# Altium schematic sheet LPCB218 - MLP INTERFACE.SchDoc
size A3; Address1: Factory 10; Address2: 9-13 Dingley Avenue, Dandeong, VICTORIA 3175, AUSTRALIA; DocumentNumber: 12; Revision: 1; SheetNumber: 12; SheetTotal: 14; Lockie__PCB_SUB_ASSEMBLY: MLP Interface; Lockie__PCB_ASSEMBLY: Command Node; Lockie__LDL: LPCB218; Lockie__PCB_DESCRIPTION: Command Node
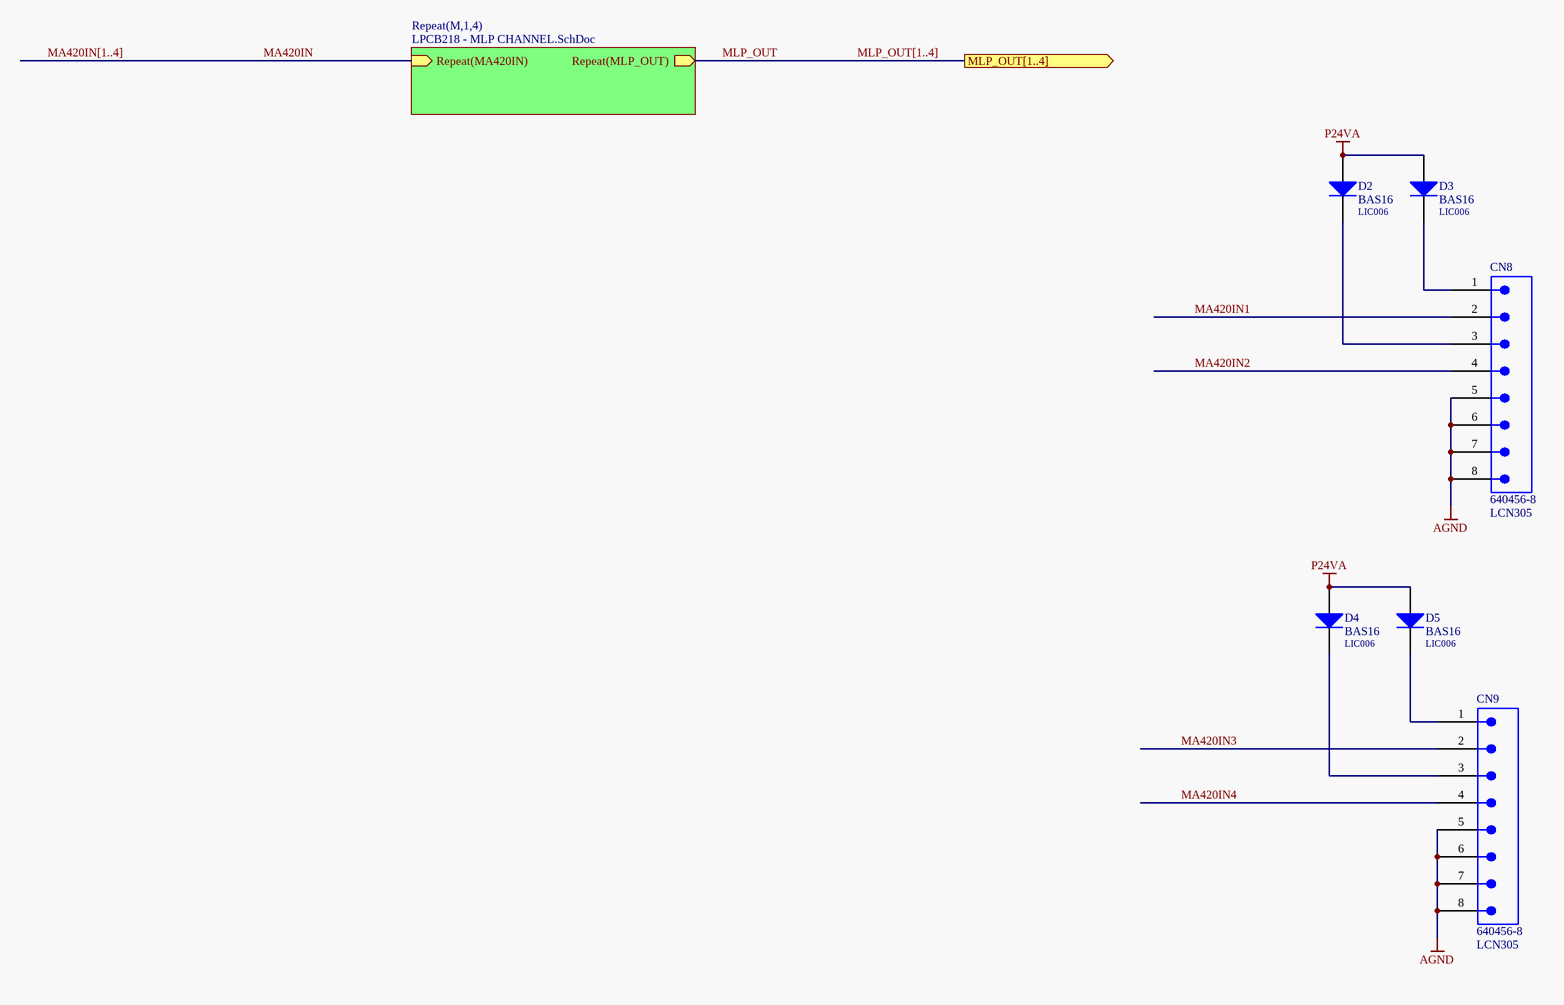
[diagram p0: LPCB218 - MLP INTERFACE.SchDoc]

## Parts
CN8  640456-8  LDL_NUMBER: LCN305  [640456-8]
CN9  640456-8  LDL_NUMBER: LCN305  [640456-8]
D2  BAS16  LDL_NUMBER: LIC006  [LFP021__SOT23]
D3  BAS16  LDL_NUMBER: LIC006  [LFP021__SOT23]
D4  BAS16  LDL_NUMBER: LIC006  [LFP021__SOT23]
D5  BAS16  LDL_NUMBER: LIC006  [LFP021__SOT23]

## Sub-sheets
Repeat(M,1,4) = LPCB218 - MLP CHANNEL.SchDoc: Repeat(MA420IN) (in), Repeat(MLP_OUT) (out)

## Ports
MLP_OUT[1..4] (out)

## Nets
AGND: CN8.5 CN8.6 CN8.7 CN8.8 CN9.5 CN9.6 CN9.7 CN9.8
P24VA: D2.1(A) D3.1(A) D4.1(A) D5.1(A)
MA420IN: sheet Repeat(M,1,4)/Repeat(MA420IN)
MA420IN1: CN8.2
MA420IN2: CN8.4
MA420IN3: CN9.2
MA420IN4: CN9.4
MLP_OUT: sheet Repeat(M,1,4)/Repeat(MLP_OUT)
NetCN8_1: CN8.1 D3.3(K)
NetCN8_3: CN8.3 D2.3(K)
NetCN9_1: CN9.1 D5.3(K)
NetCN9_3: CN9.3 D4.3(K)

## Buses and harness runs
bus MA420IN[1..4]
bus MLP_OUT[1..4] = port MLP_OUT[1..4]

## Notes on the sheet
- PCB COMPONENT DESCRIPTION
- LDL NUMBER
- Assembly Details
- Size
- Drawing File Name
- Revision
- http://rloop.org
- Scale
- A3
- Sheet Details
- N.T.S
- Sheet:
- Of:

## Library data of the parts
CN8 CN9 = 640456-8: Connector, Male Header, 8 Way; FMEDA__CHANNEL: COM; FMEDA__OPERATING__CURRENT_MAX: 0; FMEDA__OPERATING__TEMP_MAX: 50; FMEDA__OPERATING__TEMP_MIN: -20; FMEDA__OPERATING__TEMP_TYP: 27; FMEDA__OPERATING__VOLTAGE_MAX: 16; FMEDA__OPERATING__VOLTAGE_TYP: 12; FMEDA__FUNCTION_IN_SYSTEM: *; FMEDA__OPERATING__CURRENT_MIN: 0; FMEDA__OPERATING__CURRENT_TYP: 0; FMEDA__OPERATING__VOLTAGE_MIN: 0
D2-D5 = BAS16: Diode, Small Signal, 0.2A, 85V, SMD SOT-23 [LIC006]; FMEDA__OPERATING__CURRENT_MIN: 0; FMEDA__OPERATING__TEMP_MIN: -20; FMEDA__OPERATING__TEMP_TYP: 27; FMEDA__OPERATING__TEMP_MAX: 50; FMEDA__CHANNEL: COM; FMEDA__OPERATING__CURRENT_MAX: 0; FMEDA__OPERATING__VOLTAGE_MIN: 0; FMEDA__OPERATING__VOLTAGE_MAX: 0; FMEDA__FUNCTION_IN_SYSTEM: *; FMEDA__OPERATING__CURRENT_TYP: 0; FMEDA__OPERATING__VOLTAGE_TYP: 0